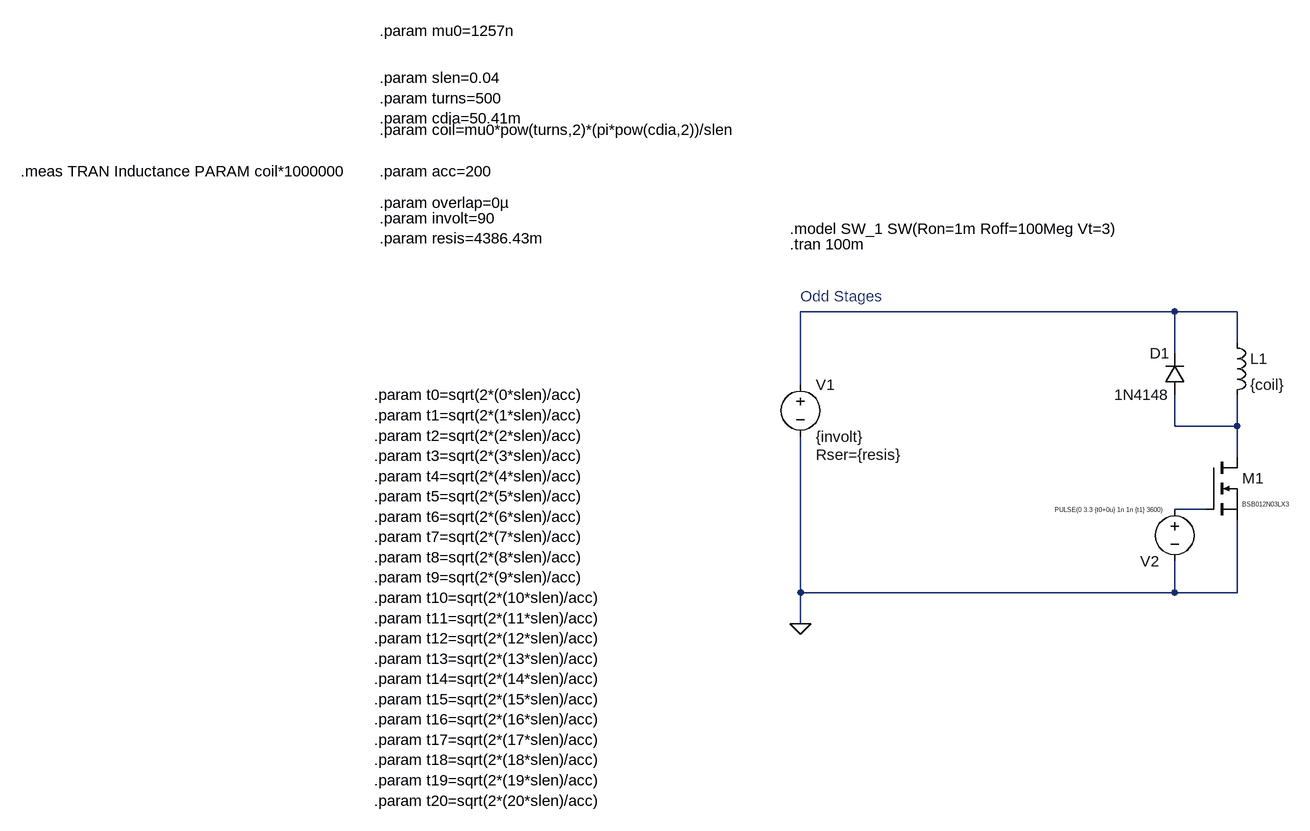
[diagram p0: schematic coilgun4-nmos-highturn.asc]
coilgun4-nmos-highturn.asc, the LTspice schematic file:
Version 4.1
SHEET 1 8016 1416
WIRE 288 -160 -288 -160
WIRE 384 -160 288 -160
WIRE 384 -112 384 -160
WIRE 288 -96 288 -160
WIRE -288 -48 -288 -160
WIRE 288 16 288 -32
WIRE 384 16 384 -32
WIRE 384 16 288 16
WIRE 384 64 384 16
WIRE 336 144 288 144
WIRE -288 272 -288 32
WIRE 288 272 288 224
WIRE 288 272 -288 272
WIRE 384 272 384 160
WIRE 384 272 288 272
WIRE -288 320 -288 272
FLAG -288 320 0
SYMBOL voltage -288 -64 R0
WINDOW 123 0 0 Left 0
WINDOW 39 24 124 Left 2
SYMATTR SpiceLine Rser={resis}
SYMATTR InstName V1
SYMATTR Value {involt}
SYMBOL ind 368 -128 R0
SYMATTR InstName L1
SYMATTR Value {coil}
SYMBOL voltage 288 128 M0
WINDOW 0 24 96 Left 2
WINDOW 3 100 10 Top 0
WINDOW 123 0 0 Left 0
WINDOW 39 0 0 Left 0
SYMATTR InstName V2
SYMATTR Value PULSE(0 3.3 {t0+0u} 1n 1n {t1} 3600)
SYMBOL nmos 336 64 R0
WINDOW 3 56 72 Left 0
SYMATTR Value BSB012N03LX3
SYMATTR InstName M1
SYMBOL diode 304 -32 R180
WINDOW 0 24 64 Left 2
WINDOW 3 24 0 Left 2
SYMATTR InstName D1
SYMATTR Value 1N4148
TEXT -304 -264 Left 2 !.tran 100m
TEXT -304 -288 Left 2 !.model SW_1 SW(Ron=1m Roff=100Meg Vt=3)
TEXT -288 -184 Left 2 ;Odd Stages
TEXT -936 -440 Left 2 !.param coil=mu0*pow(turns,2)*(pi*pow(cdia,2))/slen
TEXT -944 -32 Left 2 !.param t0=sqrt(2*(0*slen)/acc)\n.param t1=sqrt(2*(1*slen)/acc)\n.param t2=sqrt(2*(2*slen)/acc)\n.param t3=sqrt(2*(3*slen)/acc)\n.param t4=sqrt(2*(4*slen)/acc)\n.param t5=sqrt(2*(5*slen)/acc)\n.param t6=sqrt(2*(6*slen)/acc)\n.param t7=sqrt(2*(7*slen)/acc)\n.param t8=sqrt(2*(8*slen)/acc)\n.param t9=sqrt(2*(9*slen)/acc)\n.param t10=sqrt(2*(10*slen)/acc)\n.param t11=sqrt(2*(11*slen)/acc)\n.param t12=sqrt(2*(12*slen)/acc)\n.param t13=sqrt(2*(13*slen)/acc)\n.param t14=sqrt(2*(14*slen)/acc)\n.param t15=sqrt(2*(15*slen)/acc)\n.param t16=sqrt(2*(16*slen)/acc)\n.param t17=sqrt(2*(17*slen)/acc)\n.param t18=sqrt(2*(18*slen)/acc)\n.param t19=sqrt(2*(19*slen)/acc)\n.param t20=sqrt(2*(20*slen)/acc)
TEXT -936 -376 Left 2 !.param acc=200
TEXT -936 -520 Left 2 !.param slen=0.04\n.param turns=500\n.param cdia=50.41m
TEXT -936 -328 Left 2 !.param overlap=0µ
TEXT -936 -304 Left 2 !.param involt=90\n.param resis=4386.43m
TEXT -936 -592 Left 2 !.param mu0=1257n
TEXT -1488 -376 Left 2 !.meas TRAN Inductance PARAM coil*1000000

The netlist it stands for:
* coilgun4-nmos-highturn.asc
V1 N001 0 {involt} Rser={resis}
L1 N001 N002 {coil}
V2 N003 0 PULSE(0 3.3 {t0+0u} 1n 1n {t1} 3600)
M1 N002 N003 0 0 BSB012N03LX3
D1 N002 N001 1N4148
.model D D
.lib standard.dio
.model NMOS NMOS
.model PMOS PMOS
.lib standard.mos
.tran 100m
.model SW_1 SW(Ron=1m Roff=100Meg Vt=3)
* Odd Stages
.param coil=mu0*pow(turns,2)*(pi*pow(cdia,2))/slen
.param t0=sqrt(2*(0*slen)/acc)
.param t1=sqrt(2*(1*slen)/acc)
.param t2=sqrt(2*(2*slen)/acc)
.param t3=sqrt(2*(3*slen)/acc)
.param t4=sqrt(2*(4*slen)/acc)
.param t5=sqrt(2*(5*slen)/acc)
.param t6=sqrt(2*(6*slen)/acc)
.param t7=sqrt(2*(7*slen)/acc)
.param t8=sqrt(2*(8*slen)/acc)
.param t9=sqrt(2*(9*slen)/acc)
.param t10=sqrt(2*(10*slen)/acc)
.param t11=sqrt(2*(11*slen)/acc)
.param t12=sqrt(2*(12*slen)/acc)
.param t13=sqrt(2*(13*slen)/acc)
.param t14=sqrt(2*(14*slen)/acc)
.param t15=sqrt(2*(15*slen)/acc)
.param t16=sqrt(2*(16*slen)/acc)
.param t17=sqrt(2*(17*slen)/acc)
.param t18=sqrt(2*(18*slen)/acc)
.param t19=sqrt(2*(19*slen)/acc)
.param t20=sqrt(2*(20*slen)/acc)
.param acc=200
.param slen=0.04
.param turns=500
.param cdia=50.41m
.param overlap=0µ
.param involt=90
.param resis=4386.43m
.param mu0=1257n
.meas TRAN Inductance PARAM coil*1000000
.backanno
.end